# Altium schematic sheet CPLD.SchDoc
size A3; SheetNumber: 12; SheetTotal: 15
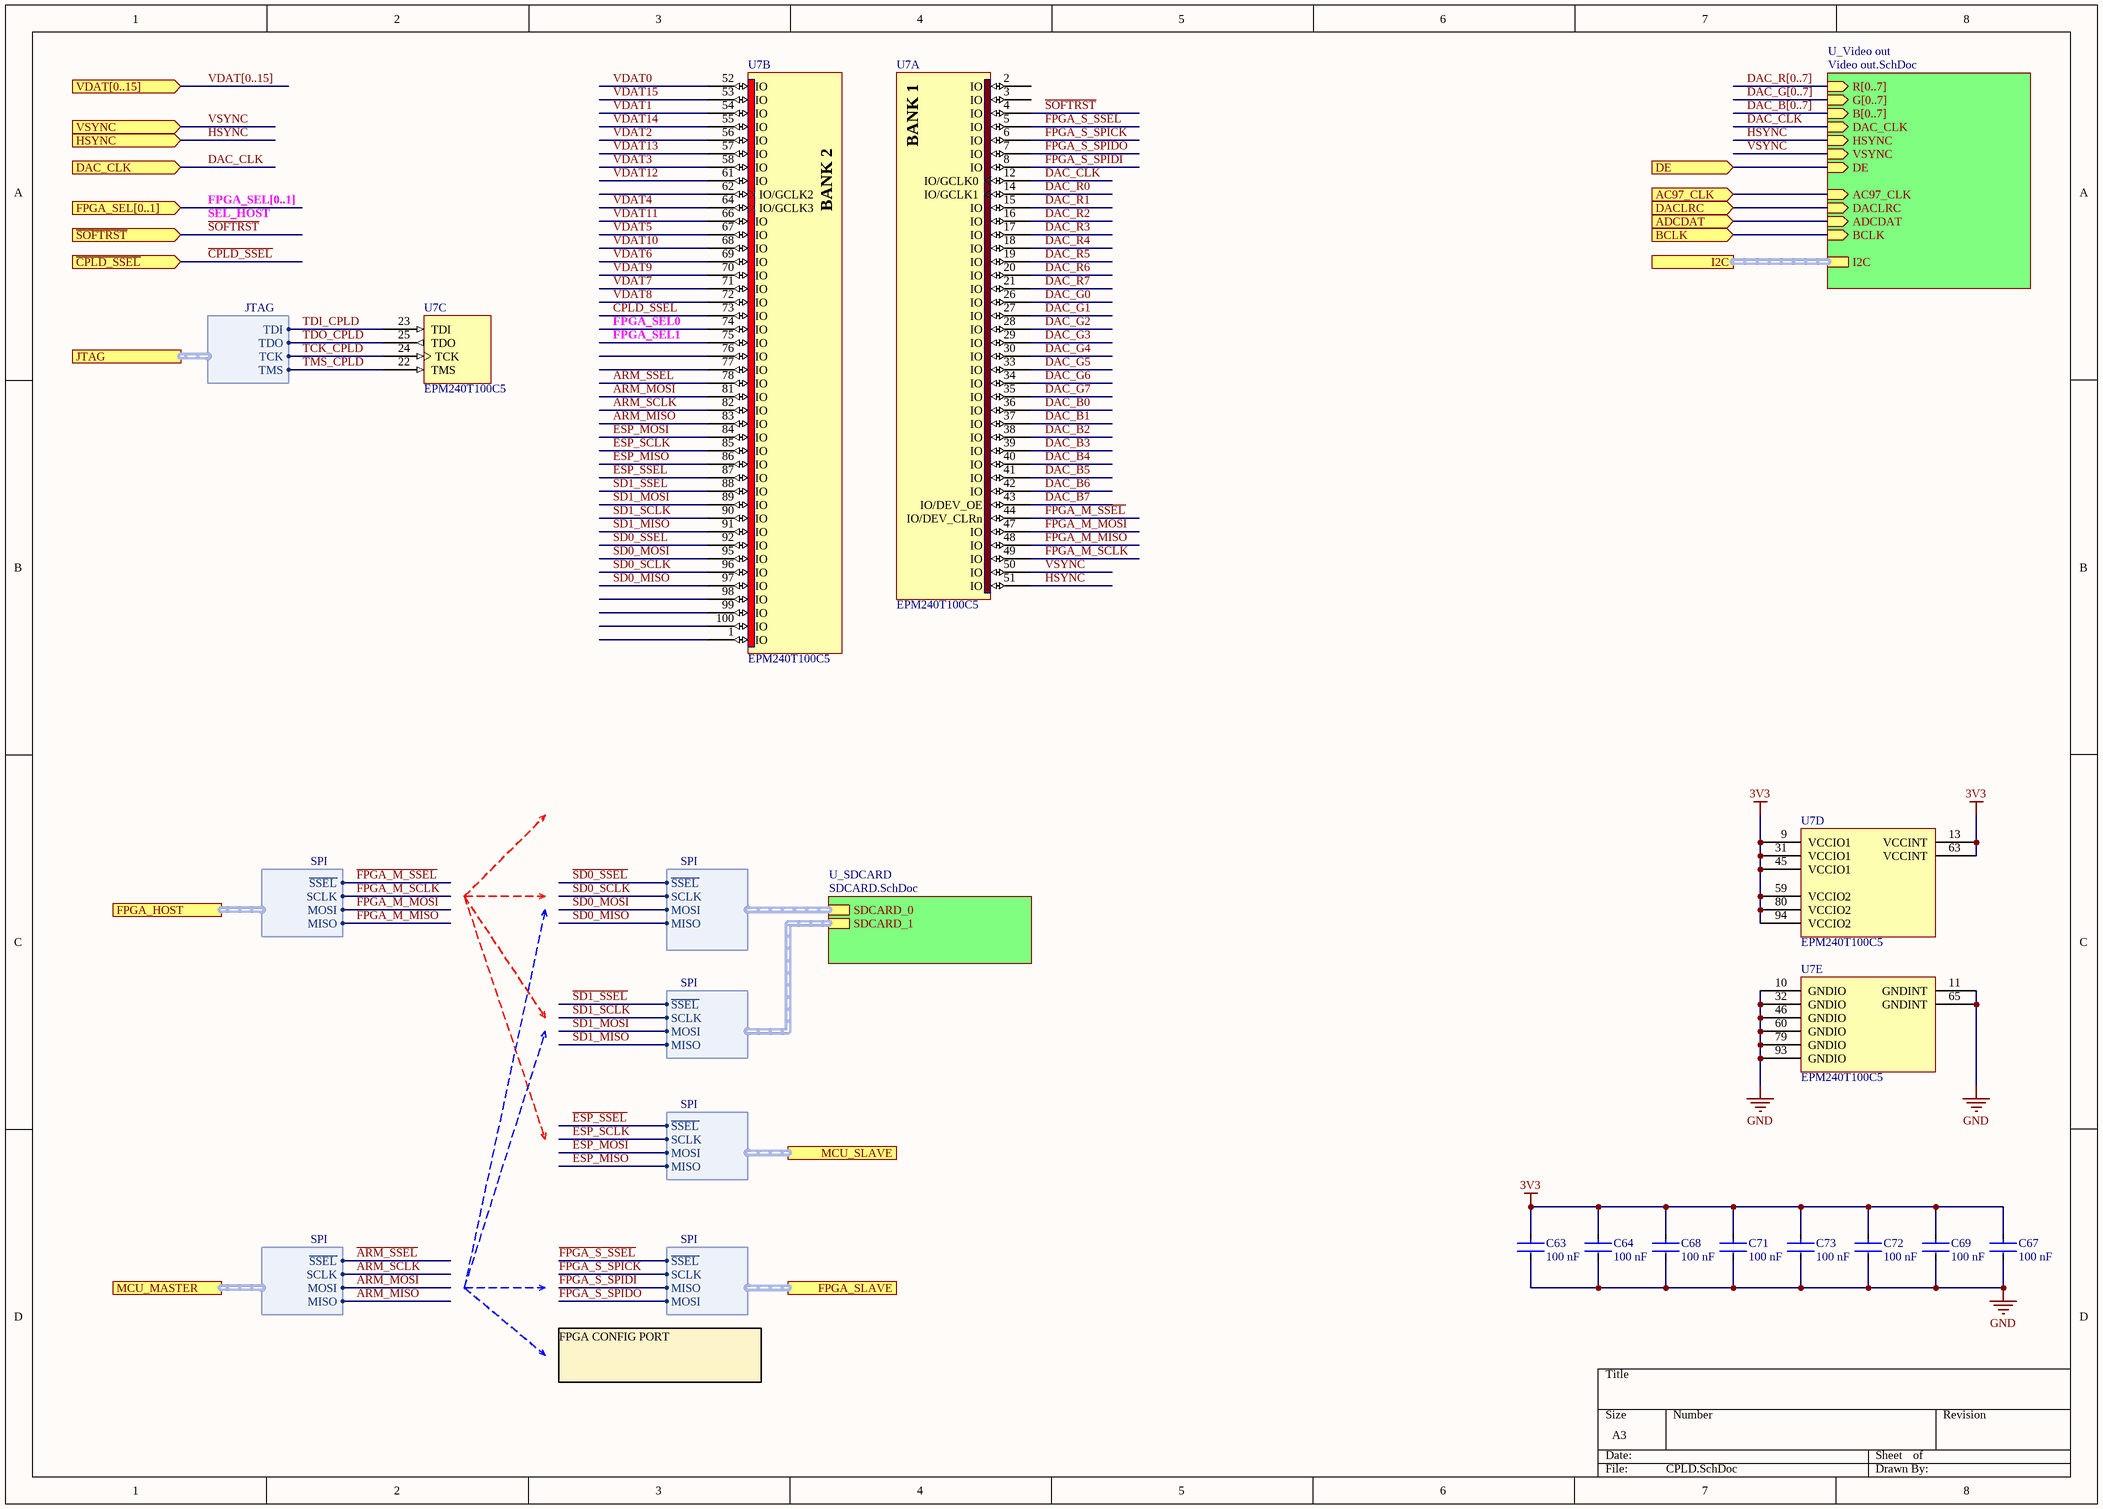
[diagram p0: CPLD.SchDoc]

## Parts
C63  Capacitance: 100 nF  [FP-CC0805-0_85-IPC_A]  (hidden comment: CC0805KRX7R9BB104)
C64  Capacitance: 100 nF  [FP-CC0805-0_85-IPC_A]  (hidden comment: CC0805KRX7R9BB104)
C67  Capacitance: 100 nF  [FP-CC0805-0_85-IPC_A]  (hidden comment: CC0805KRX7R9BB104)
C68  Capacitance: 100 nF  [FP-CC0805-0_85-IPC_A]  (hidden comment: CC0805KRX7R9BB104)
C69  Capacitance: 100 nF  [FP-CC0805-0_85-IPC_A]  (hidden comment: CC0805KRX7R9BB104)
C71  Capacitance: 100 nF  [FP-CC0805-0_85-IPC_A]  (hidden comment: CC0805KRX7R9BB104)
C72  Capacitance: 100 nF  [FP-CC0805-0_85-IPC_A]  (hidden comment: CC0805KRX7R9BB104)
C73  Capacitance: 100 nF  [FP-CC0805-0_85-IPC_A]  (hidden comment: CC0805KRX7R9BB104)
U7  EPM240T100C5  [TQFP100_M]  (parts A,B,C,D,E of 5)

## Sub-sheets
U_SDCARD = SDCARD.SchDoc: SDCARD_0 (harness SPI), SDCARD_1 (harness SPI)
U_Video out = Video out.SchDoc: R[0..7] (in), G[0..7] (in), B[0..7] (in), DAC_CLK (in), HSYNC (in), VSYNC (in), AC97_CLK (in), DACLRC (in), ADCDAT (in), BCLK (in), DE (in), I2C (harness I2C)

## Ports
AC97_CLK (in), ADCDAT (in), BCLK (in), DAC_CLK (in), DACLRC (in), DE (in), FPGA_HOST (harness SPI), FPGA_SEL[0..1] (in), FPGA_SLAVE (harness SPI), HSYNC (in), I2C (harness I2C), JTAG (harness JTAG), MCU_MASTER (harness SPI), MCU_SLAVE (harness SPI), VDAT[0..15] (in), VSYNC (in), ~{CPLD_SSEL} (in), ~{SOFTRST} (in)

## Harnesses
SPI: ~{SSEL}, SCLK, MOSI, MISO
JTAG: TCK, TDO, TDI, TMS

## Nets
3V3: C63.1 C64.1 C67.1 C68.1 C69.1 C71.1 C72.1 C73.1 U7.9(VCCIO1) U7.13(VCCINT) U7.31(VCCIO1) U7.45(VCCIO1) U7.59(VCCIO2) U7.63(VCCINT) U7.80(VCCIO2) U7.94(VCCIO2)
GND: C63.2 C64.2 C67.2 C68.2 C69.2 C71.2 C72.2 C73.2 U7.10(GNDIO) U7.11(GNDINT) U7.32(GNDIO) U7.46(GNDIO) U7.60(GNDIO) U7.65(GNDINT) U7.79(GNDIO) U7.93(GNDIO)
~{ARM_SSEL}: U7.78(IO) ; port MCU_MASTER.~{SSEL}
AC97_CLK: port AC97_CLK, sheet U_Video out/AC97_CLK
ADCDAT: port ADCDAT, sheet U_Video out/ADCDAT
ARM_MISO: U7.83(IO) ; port MCU_MASTER.MISO
ARM_MOSI: U7.81(IO) ; port MCU_MASTER.MOSI
ARM_SCLK: U7.82(IO) ; port MCU_MASTER.SCLK
BCLK: port BCLK, sheet U_Video out/BCLK
~{CPLD_SSEL}: U7.73(IO) ; port ~{CPLD_SSEL}
DAC_B0: U7.36(IO)
DAC_B1: U7.37(IO)
DAC_B2: U7.38(IO)
DAC_B3: U7.39(IO)
DAC_B4: U7.40(IO)
DAC_B5: U7.41(IO)
DAC_B6: U7.42(IO)
DAC_B7: U7.43(IO/DEV_OE)
DAC_CLK: U7.12(IO/GCLK0) ; port DAC_CLK, sheet U_Video out/DAC_CLK
DAC_G0: U7.26(IO)
DAC_G1: U7.27(IO)
DAC_G2: U7.28(IO)
DAC_G3: U7.29(IO)
DAC_G4: U7.30(IO)
DAC_G5: U7.33(IO)
DAC_G6: U7.34(IO)
DAC_G7: U7.35(IO)
DAC_R0: U7.14(IO/GCLK1)
DAC_R1: U7.15(IO)
DAC_R2: U7.16(IO)
DAC_R3: U7.17(IO)
DAC_R4: U7.18(IO)
DAC_R5: U7.19(IO)
DAC_R6: U7.20(IO)
DAC_R7: U7.21(IO)
DACLRC: port DACLRC, sheet U_Video out/DACLRC
DE: port DE, sheet U_Video out/DE
~{ESP_SSEL}: U7.87(IO) ; port MCU_SLAVE.~{SSEL}
ESP_MISO: U7.86(IO) ; port MCU_SLAVE.MISO
ESP_MOSI: U7.84(IO) ; port MCU_SLAVE.MOSI
ESP_SCLK: U7.85(IO) ; port MCU_SLAVE.SCLK
~{FPGA_M_}~{SSEL}: U7.44(IO/DEV_CLRn) ; port FPGA_HOST.~{SSEL}
~{FPGA_S_SSEL}: U7.5(IO) ; port FPGA_SLAVE.~{SSEL}
FPGA_M_MISO: U7.48(IO) ; port FPGA_HOST.MISO
FPGA_M_MOSI: U7.47(IO) ; port FPGA_HOST.MOSI
FPGA_M_SCLK: U7.49(IO) ; port FPGA_HOST.SCLK
FPGA_S_SPICK: U7.6(IO) ; port FPGA_SLAVE.SCLK
FPGA_S_SPIDI: U7.8(IO) ; port FPGA_SLAVE.MISO
FPGA_S_SPIDO: U7.7(IO) ; port FPGA_SLAVE.MOSI
FPGA_SEL0: U7.74(IO)
FPGA_SEL1: U7.75(IO)
HSYNC: U7.51(IO) ; port HSYNC, sheet U_Video out/HSYNC
~{SD0_SSEL}: U7.92(IO) ; sheet U_SDCARD/SDCARD_0.~{SSEL}
~{SD1_SSEL}: U7.88(IO) ; sheet U_SDCARD/SDCARD_1.~{SSEL}
~{SOFTRST}: U7.4(IO) ; port ~{SOFTRST}
SD0_MISO: U7.97(IO) ; sheet U_SDCARD/SDCARD_0.MISO
SD0_MOSI: U7.95(IO) ; sheet U_SDCARD/SDCARD_0.MOSI
SD0_SCLK: U7.96(IO) ; sheet U_SDCARD/SDCARD_0.SCLK
SD1_MISO: U7.91(IO) ; sheet U_SDCARD/SDCARD_1.MISO
SD1_MOSI: U7.89(IO) ; sheet U_SDCARD/SDCARD_1.MOSI
SD1_SCLK: U7.90(IO) ; sheet U_SDCARD/SDCARD_1.SCLK
TCK_CPLD: U7.24(TCK) ; port JTAG.TCK
TDI_CPLD: U7.23(TDI) ; port JTAG.TDI
TDO_CPLD: U7.25(TDO) ; port JTAG.TDO
TMS_CPLD: U7.22(TMS) ; port JTAG.TMS
VDAT0: U7.52(IO)
VDAT1: U7.54(IO)
VDAT2: U7.56(IO)
VDAT3: U7.58(IO)
VDAT4: U7.64(IO/GCLK3)
VDAT5: U7.67(IO)
VDAT6: U7.69(IO)
VDAT7: U7.71(IO)
VDAT8: U7.72(IO)
VDAT9: U7.70(IO)
VDAT10: U7.68(IO)
VDAT11: U7.66(IO)
VDAT12: U7.61(IO)
VDAT13: U7.57(IO)
VDAT14: U7.55(IO)
VDAT15: U7.53(IO)
VSYNC: U7.50(IO) ; port VSYNC, sheet U_Video out/VSYNC

Not connected (* = marked no-connect by the designer): U7 1(IO) 2(IO) 3(IO) 62(IO/GCLK2) 76(IO) 77(IO) 98(IO) 99(IO) 100(IO)

## Buses and harness runs
bus DAC_B[0..7] = sheet U_Video out/B[0..7]
bus DAC_G[0..7] = sheet U_Video out/G[0..7]
bus DAC_R[0..7] = sheet U_Video out/R[0..7]
bus FPGA_SEL[0..1] = port FPGA_SEL[0..1]
bus VDAT[0..15] = port VDAT[0..15]
harness port I2C = sheet U_Video out/I2C

## Notes on the sheet
- FPGA CONFIG PORT
- Labels drawn without touching a wire or pin: SEL_HOST
- (in symbol CMP-0144-00216-1, part A) BANK 1
- (in symbol CMP-0144-00216-1, part B) BANK 2

## Library data of the parts
C63 C64 C67-C69 C71-C73 = CMP-2100-03606-3: CAP CER 0.1UF 50V X7R 0805; Manufacturer: Yageo; Value: 100 nF; Category: Cap; Manufacturer Part Number: CC0805KRX7R9BB104; Case/Package: 0805
U7 = CMP-0144-00216-1: MAX II 3.3/2.5V CPLD, 80 IOs, 240 Logic Elements, 100-Pin Plastic TQFP, Commercial Temperature, Speed Grade 5; Manufacturer: Intel Altera; PackageDescription: 100-Pin Plastic Thin Quad Flat Pack (TQFP100) - Wire Bond; Manufacturer Part Number: EPM240T100C5; value: EPM240T100C5; Case/Package: TQFP-100; Category: IC